# Altium schematic sheet Controlador de velocidad.SchDoc
size A4
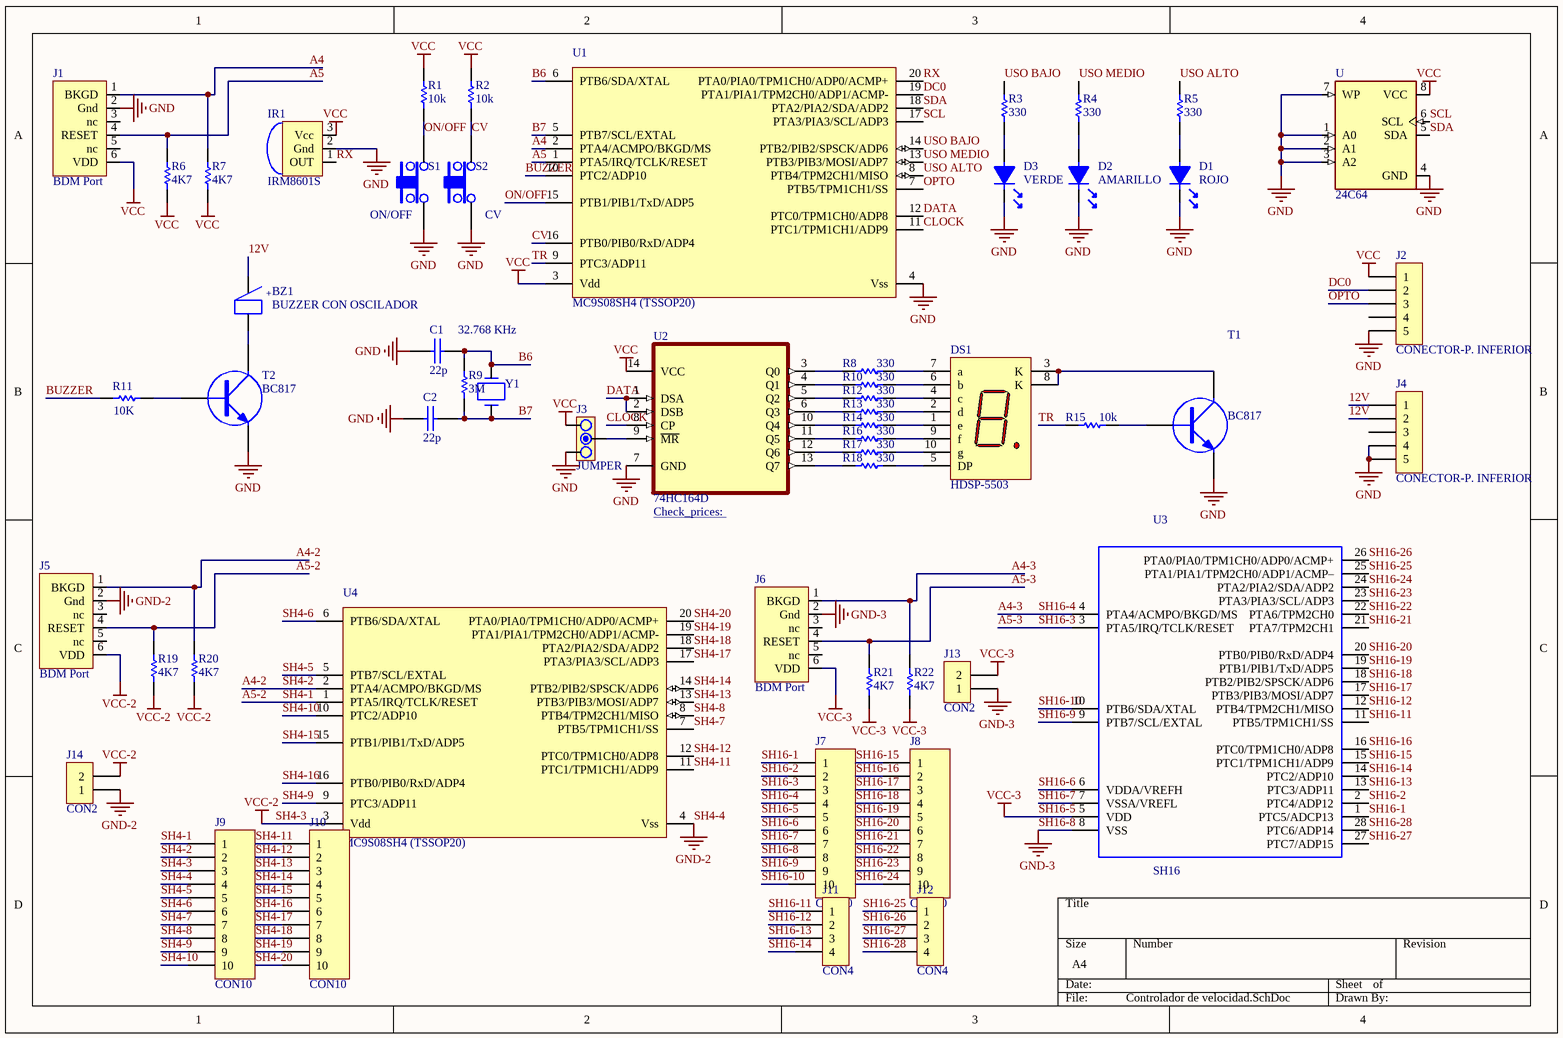
[diagram p0: Controlador de velocidad.SchDoc]

## Parts
BZ1  BUZZER CON OSCILADOR  [BUZZER 12MM]
C1  22p  [0805]
C2  22p  [0805]
D1  ROJO  [LED5]
D2  AMARILLO  [LED5]
D3  VERDE  [LED5]
DS1  HDSP-5503  [H-10]
IR1  IRM8601S  [IRM8601S]
J1  BDM Port  [JBDM]
J2  CONECTOR-P. INFERIOR  [SIP5]
J3  JUMPER  [JUMPER3]
J4  CONECTOR-P. INFERIOR  [SIP5]
J5  BDM Port  [JBDM]
J6  BDM Port  [JBDM]
J7  CON10  [SIP10]
J8  CON10  [SIP10]
J9  CON10  [SIP10]
J10  CON10  [SIP10]
J11  CON4  [SIP4]
J12  CON4  [SIP4]
J13  CON2  [SIP2]
J14  CON2  [SIP2]
R1  10k  [0805]
R2  10k  [0805]
R3  330  [0805]
R4  330  [0805]
R5  330  [0805]
R6  4K7  [0805]
R7  4K7  [0805]
R8  330  [0805]
R9  3M  [0805]
R10  330  [0805]
R11  10K  [0805]
R12  330  [0805]
R13  330  [0805]
R14  330  [0805]
R15  10k  [0805]
R16  330  [0805]
R17  330  [0805]
R18  330  [0805]
R19  4K7  [0805]
R20  4K7  [0805]
R21  4K7  [0805]
R22  4K7  [0805]
S1  ON/OFF  [TACTSWITCH]
S2  CV  [TACTSWITCH]
T1  BC817  [SOT23]
T2  BC817  [SOT23]
U  24C64  [SOIC127P600X175-8N]
U1  MC9S08SH4 (TSSOP20)  [TSSOP20]
U2  74HC164D  [SOIC127P600X175-14N]
U3  SH16  [*SOIC127P1032X265-28N]
U4  MC9S08SH4 (TSSOP20)  [TSSOP20]
Y1  32.768 KHz  [X32768]

## Nets
GND: C1.2 C2.2 D1.2 D2.2 D3.2 IR1.2(Gnd) J1.2(Gnd) J2.5 J3.1 J4.4 J4.5 S1.1 S2.1 T1.3(E) T2.3(E) U.1(A0) U.2(A1) U.3(A2) U.4(GND) U.7(WP) U1.4(Vss) U2.7(GND)
SH4-3: J5.6(VDD) J9.3 J14.2 R19.1 R20.1 U4.3(Vdd)  [also labelled VCC-2]
SH4-4: J5.2(Gnd) J9.4 J14.1 U4.4(Vss)  [also labelled GND-2]
SH16-5: J6.6(VDD) J7.5 J13.2 R21.1 R22.1 U3.5(VDD)  [also labelled VCC-3]
SH16-8: J6.2(Gnd) J7.8 J13.1 U3.8(VSS)  [also labelled GND-3]
VCC: IR1.3(Vcc) J1.6(VDD) J2.1 J3.3 R1.2 R2.2 R6.1 R7.1 U.8(VCC) U1.3(Vdd) U2.14(VCC)
12V: BZ1.1 J4.1 J4.2
A4: J1.1(BKGD) R7.2 U1.2(PTA4/ACMPO/BKGD/MS)
A4-2: J5.1(BKGD) J9.2 R20.2 U4.2(PTA4/ACMPO/BKGD/MS)  [also labelled SH4-2]
A4-3: J6.1(BKGD) J7.4 R22.2 U3.4(PTA4/ACMPO/BKGD/MS)  [also labelled SH16-4]
A5: J1.4(RESET) R6.2 U1.1(PTA5/IRQ/TCLK/RESET)
A5-2: J5.4(RESET) J9.1 R19.2 U4.1(PTA5/IRQ/TCLK/RESET)  [also labelled SH4-1]
A5-3: J6.4(RESET) J7.3 R21.2 U3.3(PTA5/IRQ/TCLK/RESET)  [also labelled SH16-3]
B6: C1.1 R9.2 U1.6(PTB6/SDA/XTAL) Y1.2
B7: C2.1 R9.1 U1.5(PTB7/SCL/EXTAL) Y1.1
BUZZER: R11.1 U1.10(PTC2/ADP10)
CLOCK: U1.11(PTC1/TPM1CH1/ADP9) U2.8(CP)
CV: R2.1 S2.2 U1.16(PTB0/PIB0/RxD/ADP4)
DATA: U1.12(PTC0/TPM1CH0/ADP8) U2.1(DSA) U2.2(DSB)
DC0: J2.2 U1.19(PTA1/PIA1/TPM2CH0/ADP1/ACMP-)
ON/OFF: R1.1 S1.2 U1.15(PTB1/PIB1/TxD/ADP5)
OPTO: J2.3 U1.7(PTB5/TPM1CH1/SS)
RX: IR1.1(OUT) U1.20(PTA0/PIA0/TPM1CH0/ADP0/ACMP+)
SCL: U.6(SCL) U1.17(PTA3/PIA3/SCL/ADP3)
SDA: U.5(SDA) U1.18(PTA2/PIA2/SDA/ADP2)
SH4-5: J9.5 U4.5(PTB7/SCL/EXTAL)
SH4-6: J9.6 U4.6(PTB6/SDA/XTAL)
SH4-7: J9.7 U4.7(PTB5/TPM1CH1/SS)
SH4-8: J9.8 U4.8(PTB4/TPM2CH1/MISO)
SH4-9: J9.9 U4.9(PTC3/ADP11)
SH4-10: J9.10 U4.10(PTC2/ADP10)
SH4-11: J10.1 U4.11(PTC1/TPM1CH1/ADP9)
SH4-12: J10.2 U4.12(PTC0/TPM1CH0/ADP8)
SH4-13: J10.3 U4.13(PTB3/PIB3/MOSI/ADP7)
SH4-14: J10.4 U4.14(PTB2/PIB2/SPSCK/ADP6)
SH4-15: J10.5 U4.15(PTB1/PIB1/TxD/ADP5)
SH4-16: J10.6 U4.16(PTB0/PIB0/RxD/ADP4)
SH4-17: J10.7 U4.17(PTA3/PIA3/SCL/ADP3)
SH4-18: J10.8 U4.18(PTA2/PIA2/SDA/ADP2)
SH4-19: J10.9 U4.19(PTA1/PIA1/TPM2CH0/ADP1/ACMP-)
SH4-20: J10.10 U4.20(PTA0/PIA0/TPM1CH0/ADP0/ACMP+)
SH16-1: J7.1 U3.1(PTC5/ADCP13)
SH16-2: J7.2 U3.2(PTC4/ADP12)
SH16-6: J7.6 U3.6(VDDA/VREFH)
SH16-7: J7.7 U3.7(VSSA/VREFL)
SH16-9: J7.9 U3.9(PTB7/SCL/EXTAL)
SH16-10: J7.10 U3.10(PTB6/SDA/XTAL)
SH16-11: J11.1 U3.11(PTB5/TPM1CH1/SS)
SH16-12: J11.2 U3.12(PTB4/TPM2CH1/MISO)
SH16-13: J11.3 U3.13(PTC3/ADP11)
SH16-14: J11.4 U3.14(PTC2/ADP10)
SH16-15: J8.1 U3.15(PTC1/TPM1CH1/ADP9)
SH16-16: J8.2 U3.16(PTC0/TPM1CH0/ADP8)
SH16-17: J8.3 U3.17(PTB3/PIB3/MOSI/ADP7)
SH16-18: J8.4 U3.18(PTB2/PIB2/SPSCK/ADP6)
SH16-19: J8.5 U3.19(PTB1/PIB1/TxD/ADP5)
SH16-20: J8.6 U3.20(PTB0/PIB0/RxD/ADP4)
SH16-21: J8.7 U3.21(PTA7/TPM2CH1)
SH16-22: J8.8 U3.22(PTA6/TPM2CH0)
SH16-23: J8.9 U3.23(PTA3/PIA3/SCL/ADP3)
SH16-24: J8.10 U3.24(PTA2/PIA2/SDA/ADP2)
SH16-25: J12.1 U3.25(PTA1/PIA1/TPM2CH0/ADP1/ACMP–)
SH16-26: J12.2 U3.26(PTA0/PIA0/TPM1CH0/ADP0/ACMP+)
SH16-27: J12.3 U3.27(PTC7/ADP15)
SH16-28: J12.4 U3.28(PTC6/ADP14)
TR: R15.1 U1.9(PTC3/ADP11)
USO ALTO: R5.2 U1.8(PTB4/TPM2CH1/MISO)
USO BAJO: R3.2 U1.14(PTB2/PIB2/SPSCK/ADP6)
USO MEDIO: R4.2 U1.13(PTB3/PIB3/MOSI/ADP7)
NetBZ1_2: BZ1.2 T2.2(C)
NetD1_1: D1.1 R5.1
NetD2_1: D2.1 R4.1
NetD3_1: D3.1 R3.1
NetDS1_1: DS1.1(e) R14.2
NetDS1_2: DS1.2(d) R13.2
NetDS1_3: DS1.3(K) DS1.8(K) T1.2(C)
NetDS1_4: DS1.4(c) R12.2
NetDS1_5: DS1.5(DP) R18.2
NetDS1_6: DS1.6(b) R10.2
NetDS1_7: DS1.7(a) R8.2
NetDS1_9: DS1.9(f) R16.2
NetDS1_10: DS1.10(g) R17.2
NetJ3_2: J3.2 U2.9(~{MR})
NetR8_1: R8.1 U2.3(Q0)
NetR10_1: R10.1 U2.4(Q1)
NetR11_2: R11.2 T2.1(B)
NetR12_1: R12.1 U2.5(Q2)
NetR13_1: R13.1 U2.6(Q3)
NetR14_1: R14.1 U2.10(Q4)
NetR15_2: R15.2 T1.1(B)
NetR16_1: R16.1 U2.11(Q5)
NetR17_1: R17.1 U2.12(Q6)
NetR18_1: R18.1 U2.13(Q7)

Not connected (* = marked no-connect by the designer): J1 3(nc) 5(nc); J2 4; J4 3; J5 3(nc) 5(nc); J6 3(nc) 5(nc)

## Notes on the sheet
- (in symbol BUZZER) +

## Library data of the parts
BZ1 = BUZZER
C1 C2 = CAP
D1-D3 = LED
DS1 = HDSP-5503: 14.22 mm Gray Surface HER 7-Segment Display: CC, RH DP; LuminousIntensity: 900 ucd (Minimum).; LED_Colour: High Efficiency Red (HER); Note: Pins 3 and 8 are redundant Cathodes.; Published: 26-May-2004; LatestRevisionDate: 11-Oct-2004; LatestRevisionNote: Display outline superimposed on PCB Footprint.; DatasheetDocument: 17-Jan-2002; PackageDocument: 24-Sep-2002; PackageReference: H-10; Publisher: Altium Limited; ComponentLink1Description: Manufacturer Link; ComponentLink1URL: http://www.agilent.com/; ComponentLink2Description: Datasheet; ComponentLink2URL: http://cp.literature.agilent.com/litweb/pdf/5988-4273EN.pdf
IR1 = IRM8601S: Sensor IR
J1 J5 J6 = JBDM
J2 J4 = CON5
J3 = JUMPER3
R1-R22 = RES
S1 S2 = TACT SWITCH: Supplier 1: Digi-Key; Supplier 2: Digi-Key
T1 T2 = TRANSISTOR NPN
U = AT24C256C-SSHL-T: EEPROM Memory IC 256Kb _32K x 8_ IÂ²C 1MHz 550ns 8-SOIC; MF: Microchip; MP: AT24C256C-SSHL-T; SnapEDA_Link: https://www.snapeda.com/parts/AT24C256C-SSHL-T/Microchip/view-part/1864067/?ref=snap; Digi-Key_Part_Number: AT24C256C-SSHL-TCT-ND; Digi-Key_Purchase_URL: https://www.digikey.com/product-detail/en/microchip-technology/AT24C256C-SSHL-T/AT24C256C-SSHL-TCT-ND/3178468?utm_source=snapeda&utm_medium=aggregator&utm_campaign=symbol; Package: SO-8 Microchip; Value: *
U1 U4 = MC9S08SH8_20
U2 = 74HC164D,653: Shift Shift Register 1 Element 8 Bit 14-SO; MF: Nexperia USA; DigiKey-Purchase-URL: https://snapeda.com/shop?store=DigiKey&id=1041733; Arrow_Asia-Purchase-URL: https://snapeda.com/shop?store=Arrow+Asia&id=1041733; Arrow_Europe-Purchase-URL: https://snapeda.com/shop?store=Arrow+Europe&id=1041733; Price: None; Availability: Good; Value: *; MP: 74HC164D,653; SnapEDA_Link: https://www.snapeda.com/parts/74HC164D,653/Nexperia%20USA%20Inc./view-part/1041733/?ref=snap; Package: SOIC-14 NXP Semiconductors; Mouser-Purchase-URL: https://snapeda.com/shop?store=Mouser&id=1041733; Arrow_Electronics-Purchase-URL: https://snapeda.com/shop?store=Arrow+Electronics&id=1041733
U3 = MAX3243EWIT: 3/5 Transceiver Full RS232 28-SOIC; MF: Maxim Integrated; Package: SOIC-28 Maxim Integrated; MP: MAX3243EWI; Price: None; SnapEDA_Link: https://www.snapeda.com/parts/MAX3243EWI/Maxim%20Integrated/view-part/991561/?ref=snap; Availability: Unavailable; Value: *
Y1 = CRYSTAL: Text Field1: 20; Text Field2: 20